# EAGLE design v3.3 (EAGLE 6.1)
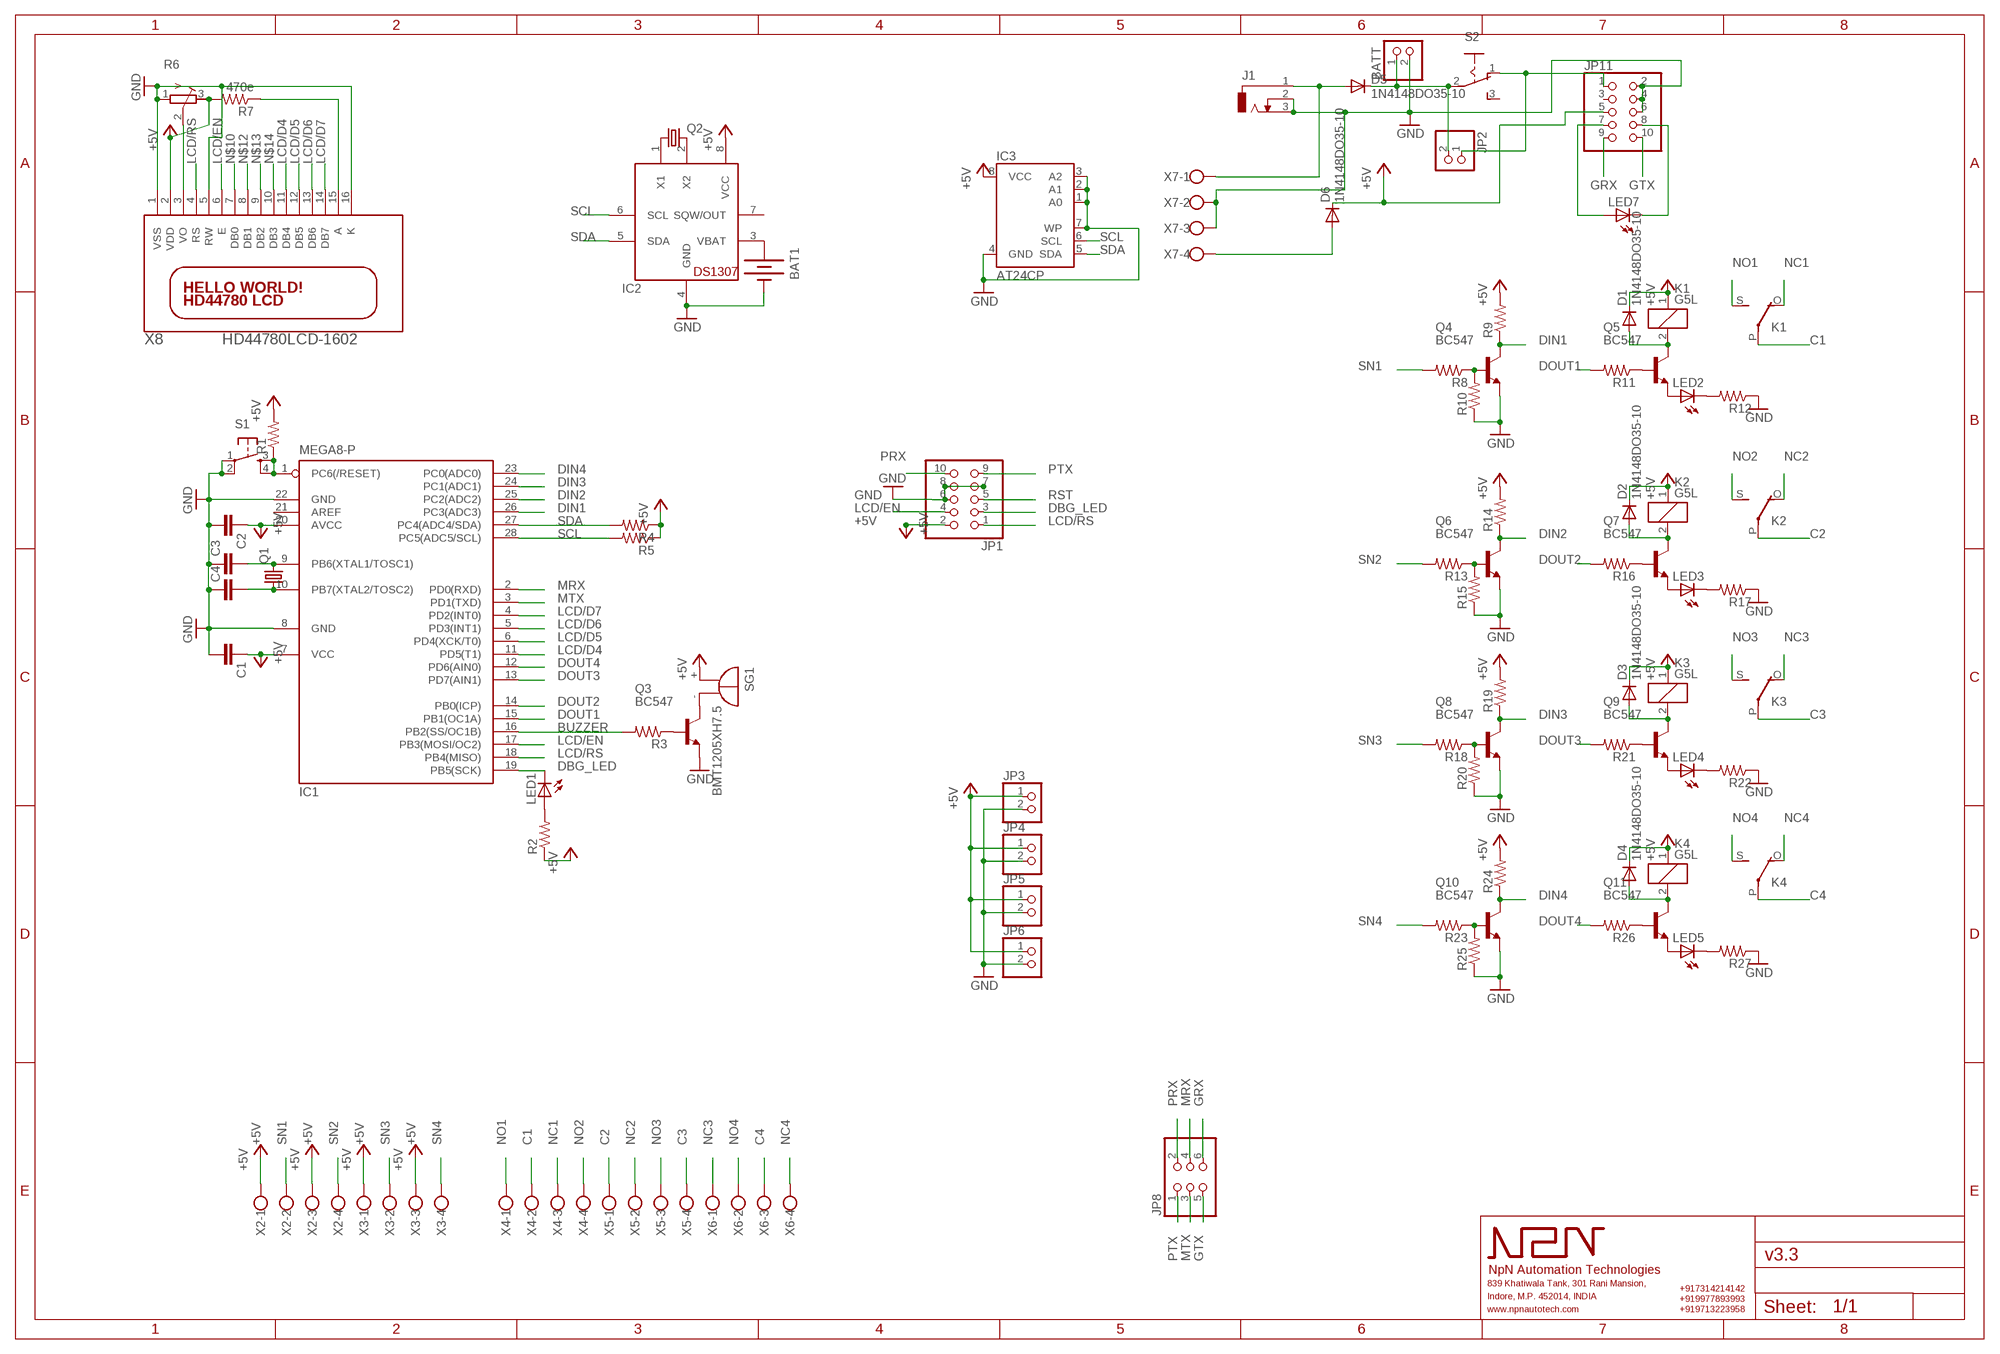
[diagram p0: schematic, sheet 1]

## Parts
BAT1  BATTERY20PTH  [BATTCOM_20MM_PTH]
BATT  PINHD-1X2  [1X02]
C1  C-EU050-025X075  [C050-025X075]
C2  C-EU050-025X075  [C050-025X075]
C3  C-EU050-025X075  [C050-025X075]
C4  C-EU050-025X075  [C050-025X075]
D1  1N4148DO35-10  [DO35-10]
D2  1N4148DO35-10  [DO35-10]
D3  1N4148DO35-10  [DO35-10]
D4  1N4148DO35-10  [DO35-10]
D5  1N4148DO35-10  [DO35-10]
D6  1N4148DO35-10  [DO35-10]
IC1  MEGA8-P  [DIL28-3]
IC2  DS1307  [DIL08]
IC3  AT24CP  [DIL08]
J1  DCJ0303  [DCJ0303]
JP1  PINHD-2X5/90  [2X05/90]
JP2  PINHD-1X2  [1X02]
JP3  PINHD-1X2  [1X02]
JP4  PINHD-1X2  [1X02]
JP5  PINHD-1X2  [1X02]
JP6  PINHD-1X2  [1X02]
JP8  PINHD-2X3/90  [2X03/90]
JP11  PINHD-2X5  [2X05]
K1  G5L  [G5LE]
K2  G5L  [G5LE]
K3  G5L  [G5LE]
K4  G5L  [G5LE]
LED1  LED5MM  [LED5MM]
LED2  LED5MM  [LED5MM]
LED3  LED5MM  [LED5MM]
LED4  LED5MM  [LED5MM]
LED5  LED5MM  [LED5MM]
LED7  LED5MM  [LED5MM]
Q1  CRYSTALHC49U-V  [HC49U-V]
Q2  CRYSTALTC38H  [TC38H]
Q3  BC547  [TO92]
Q4  BC547  [TO92]
Q5  BC547  [TO92]
Q6  BC547  [TO92]
Q7  BC547  [TO92]
Q8  BC547  [TO92]
Q9  BC547  [TO92]
Q10  BC547  [TO92]
Q11  BC547  [TO92]
R1  R-US_0207/10  [0207/10]
R2  R-US_0207/10  [0207/10]
R3  R-US_0207/10  [0207/10]
R4  R-US_0207/10  [0207/10]
R5  R-US_0207/10  [0207/10]
R6  R-TRIMM3339P  [RTRIM3339P]
R7  470e  R-US_0207/10  [0207/10]
R8  R-US_0207/10  [0207/10]
R9  R-US_0207/10  [0207/10]
R10  R-US_0207/10  [0207/10]
R11  R-US_0207/10  [0207/10]
R12  R-US_0207/10  [0207/10]
R13  R-US_0207/10  [0207/10]
R14  R-US_0207/10  [0207/10]
R15  R-US_0207/10  [0207/10]
R16  R-US_0207/10  [0207/10]
R17  R-US_0207/10  [0207/10]
R18  R-US_0207/10  [0207/10]
R19  R-US_0207/10  [0207/10]
R20  R-US_0207/10  [0207/10]
R21  R-US_0207/10  [0207/10]
R22  R-US_0207/10  [0207/10]
R23  R-US_0207/10  [0207/10]
R24  R-US_0207/10  [0207/10]
R25  R-US_0207/10  [0207/10]
R26  R-US_0207/10  [0207/10]
R27  R-US_0207/10  [0207/10]
S1  TAC_SWITCHPTH  [TACTILE-PTH]
S2  M251  [M251]
SG1  BMT1205XH7.5  [BMT1205XH7.5]
X2  W237-4  [W237-4]
X3  W237-4  [W237-4]
X4  W237-4  [W237-4]
X5  W237-4  [W237-4]
X6  W237-4  [W237-4]
X7  W237-4  [W237-4]
X8  HD44780LCD-1602  [LCD1602]

## Nets
+5V: C1.1 C2.1 D1.C D2.C D3.C D4.C D6.C IC1.7(VCC) IC1.20(AVCC) IC2.8(VCC) IC3.8(VCC) JP1.2 JP3.1 JP4.1 JP5.1 JP6.1 JP11.5 K1.1 K2.1 K3.1 K4.1 R1.2 R2.1 R4.1 R5.1 R9.2 R14.2 R19.2 R24.2 SG1.+ X2.1 X2.3 X3.1 X3.3
BUZZER: IC1.16(PB2(SS/OC1B)) R3.2
C1: K1.P(2:P) X4.2
C2: K2.P(2:P) X5.1
C3: K3.P(2:P) X5.4
C4: K4.P(2:P) X6.3
DBG_LED: IC1.19(PB5(SCK)) JP1.3 LED1.K(C)
DIN1: IC1.26(PC3(ADC3)) Q4.3(C) R9.1
DIN2: IC1.25(PC2(ADC2)) Q6.3(C) R14.1
DIN3: IC1.24(PC1(ADC1)) Q8.3(C) R19.1
DIN4: IC1.23(PC0(ADC0)) Q10.3(C) R24.1
DOUT1: IC1.15(PB1(OC1A)) R11.2
DOUT2: IC1.14(PB0(ICP)) R16.2
DOUT3: IC1.13(PD7(AIN1)) R21.2
DOUT4: IC1.12(PD6(AIN0)) R26.2
GND: BAT1.2(-) BATT.2 C1.2 C2.2 C3.1 C4.1 IC1.8(GND) IC1.22(GND) IC2.4(GND) IC3.1(A0) IC3.2(A1) IC3.3(A2) IC3.4(GND) IC3.7(WP) J1.2 J1.3 JP1.6 JP1.7 JP1.8 JP3.2 JP4.2 JP5.2 JP6.2 JP11.2 JP11.4 JP11.6 Q3.1(E) Q4.1(E) Q6.1(E) Q8.1(E) Q10.1(E) R10.1 R12.1 R15.1 R17.1 R20.1 R22.1 R25.1 R27.1 S1.1 S1.2 X7.2 X7.3
GRX: JP8.6 JP11.9
GTX: JP8.5 JP11.10
LCD/D4: IC1.11(PD5(T1)) X8.11(DB4)
LCD/D5: IC1.6(PD4(XCK/T0)) X8.12(DB5)
LCD/D6: IC1.5(PD3(INT1)) X8.13(DB6)
LCD/D7: IC1.4(PD2(INT0)) X8.14(DB7)
LCD/EN: IC1.17(PB3(MOSI/OC2)) JP1.4 X8.6(E)
LCD/RS: IC1.18(PB4(MISO)) JP1.1 X8.4(RS)
MRX: IC1.2(PD0(RXD)) JP8.4
MTX: IC1.3(PD1(TXD)) JP8.3
N$1: IC2.2(X2) Q2.2
N$2: R7.1 X8.15(A)
N$3: IC2.1(X1) Q2.1
N$4: LED1.A R2.2
N$5: C3.2 IC1.9(PB6(XTAL1/TOSC1)) Q1.2
N$6: C4.2 IC1.10(PB7(XTAL2/TOSC2)) Q1.1
N$7: Q3.2(B) R3.1
N$8: Q3.3(C) SG1.-
N$9: R6.2(S) X8.3(VO)
N$10: X8.7(DB0)
N$11: BAT1.1(+) IC2.3(VBAT)
N$12: X8.8(DB1)
N$13: X8.9(DB2)
N$14: X8.10(DB3)
N$15: D6.A X7.4
N$16: Q4.2(B) R8.1 R10.2
N$17: JP2.1 JP11.1 S2.1(O)
N$18: Q5.2(B) R11.1
N$19: LED2.A Q5.1(E)
N$20: LED2.K(C) R12.2
N$21: D1.A K1.2 Q5.3(C)
N$22: D5.A J1.1 X7.1
N$23: BATT.1 D5.C JP2.2 S2.2(P)
N$27: Q6.2(B) R13.1 R15.2
N$28: Q7.2(B) R16.1
N$29: LED3.A Q7.1(E)
N$30: LED3.K(C) R17.2
N$31: D2.A K2.2 Q7.3(C)
N$32: Q8.2(B) R18.1 R20.2
N$33: Q9.2(B) R21.1
N$34: LED4.A Q9.1(E)
N$35: LED4.K(C) R22.2
N$36: D3.A K3.2 Q9.3(C)
N$37: Q10.2(B) R23.1 R25.2
N$38: Q11.2(B) R26.1
N$39: LED5.A Q11.1(E)
N$40: LED5.K(C) R27.2
N$41: D4.A K4.2 Q11.3(C)
N$50: JP11.7 LED7.A
N$51: JP11.8 LED7.K(C)
NC1: K1.O(2:O) X4.3
NC2: K2.O(2:O) X5.2
NC3: K3.O(2:O) X6.1
NC4: K4.O(2:O) X6.4
NO1: K1.S(2:S) X4.1
NO2: K2.S(2:S) X4.4
NO3: K3.S(2:S) X5.3
NO4: K4.S(2:S) X6.2
PRX: JP1.10 JP8.2
PTX: JP1.9 JP8.1
RST: IC1.1(PC6(/RESET)) JP1.5 R1.1 S1.3 S1.4
SCL: IC1.28(PC5(ADC5/SCL)) IC2.6(SCL) IC3.6(SCL) R5.2
SDA: IC1.27(PC4(ADC4/SDA)) IC2.5(SDA) IC3.5(SDA) R4.2
SN1: R8.2 X2.2
SN2: R13.2 X2.4
SN3: R18.2 X3.2
SN4: R23.2 X3.4
VDD: R6.3(E) R7.2 X8.2(VDD) ; supply symbol labelled +5V
VSS: R6.1(A) X8.1(VSS) X8.5(RW) X8.16(K) ; supply symbol labelled GND
Unconnected: IC1.21(AREF) IC2.7(SQW/OUT) JP11.3 S2.3(S)

## Library data of the parts
BAT1 = SparkFun-Electromechanical:BATTERY: Battery Holders Various common sizes : AA, AAA, 20mm coin cell and 12mm coin cell. 20MM_4LEGS, BATT-10373
BATT JP2-JP6 = pinhead:PINHD-1X2: PIN HEADER
C1-C4 = rcl:C-EU: CAPACITOR, European symbol
D1-D6 = diode:1N4148: DIODE high speed (Philips)
IC1 = atmel:MEGA8-P: MICROCONTROLLER 8 Kbytes FLASH, 1 kbytes SRAM, 512 bytes EEPROM, USART, 4-channel 10 bit ADC, 2-channel 8 bit ADC Pin compatible with Atmega48, ATMega88, ATMega168 Source: avr.lbr; OC_FARNELL: unknown; OC_NEWARK: unknown
IC2 = adafruit:DS1307: DS1307 Real time clock (RTC) with battery backup ability. Talk to it via i2c
IC3 = atmel:AT24C*: 2-wire serial EEPROM; MPN: AT24C1024BW-SH-B; OC_FARNELL: 1362646; OC_NEWARK: 03P2044
J1 = con-jack:DCJ0303: DC POWER JACK Source: DCJ0303.pdf; OC_FARNELL: unknown; OC_NEWARK: unknown
JP1 JP11 = pinhead:PINHD-2X5: PIN HEADER
JP8 = pinhead:PINHD-2X3: PIN HEADER
K1-K4 = relay:G5L: RELAY 1 x switch, 10 A/120 V AC, 8 A/30 V ADC, Omron; OC_FARNELL: unknown; OC_NEWARK: unknown
LED1-LED5 LED7 = led:LED: LED OSRAM: - CHIPLED LG R971, LG N971, LY N971, LG Q971, LY Q971, LO R971, LY R971 LH N974, LH R974 LS Q976, LO Q976, LY Q976 LO Q996 - Hyper CHIPLED LW Q18S LB Q993, LB Q99A, LB R99A - SideLED LS A670, LO A670, LY A670, LG A670, LP A670 LB A673, LV A673, LT A673, LW A673 LH A674 LY A675 LS A676, LA A676, LO A676, LY A676, LW A676 LS A679, LY A679, LG A679 - Hyper Micro SIDELED® LS Y876, LA Y876, LO Y876, LY Y876 LT Y87S - SmartLED LW L88C, LW L88S LB L89C, LB L89S, LG L890 LS L89K, LO L89K, LY L89K LS L896, LA L896, LO L896, LY L896 - TOPLED LS T670, LO T670, LY T670, LG T670, LP T670 LSG T670, LSP T670, LSY T670, LOP T670, LYG T670 LG T671, LOG T671, LSG T671 LB T673, LV T673, LT T673, LW T673 LH T674 LS T676, LA T676, LO T676, LY T676, LB T676, LH T676, LSB T676, LW T676 LB T67C, LV T67C, LT T67C, LS T67K, LO T67K, LY T67K, LW E67C LS E67B, LA E67B, LO E67B, LY E67B, LB E67C, LV E67C, LT E67C LW T67C LS T679, LY T679, LG T679 LS T770, LO T770, LY T770, LG T770, LP T770 LB T773, LV T773, LT T773, LW T773 LH T774 LS E675, LA E675, LY E675, LS T675 LS T776, LA T776, LO T776, LY T776, LB T776 LHGB T686 LT T68C, LB T68C - Hyper Mini TOPLED® LB M676 - Mini TOPLED Santana® LG M470 LS M47K, LO M47K, LY M47K Source: http://www.osram.convergy.de LUXEON: - LUMILED® LXK2-PW12-R00, LXK2-PW12-S00, LXK2-PW14-U00, LXK2-PW14-V00 LXK2-PM12-R00, LXK2-PM12-S00, LXK2-PM14-U00 LXK2-PE12-Q00, LXK2-PE12-R00, LXK2-PE12-S00, LXK2-PE14-T00, LXK2-PE14-U00 LXK2-PB12-K00, LXK2-PB12-L00, LXK2-PB12-M00, LXK2-PB14-N00, LXK2-PB14-P00, LXK2-PB14-Q00 LXK2-PR12-L00, LXK2-PR12-M00, LXK2-PR14-Q00, LXK2-PR14-R00 LXK2-PD12-Q00, LXK2-PD12-R00, LXK2-PD12-S00 LXK2-PH12-R00, LXK2-PH12-S00 LXK2-PL12-P00, LXK2-PL12-Q00, LXK2-PL12-R00 Source: www.luxeon.com KINGBRIGHT: KA-3528ASYC Source: www.kingbright.com
Q1 = crystal:CRYSTAL: CRYSTAL; OC_FARNELL: 1666969; OC_NEWARK: unknown
Q2 = crystal:CRYSTAL: CRYSTAL; OC_FARNELL: unknown; OC_NEWARK: unknown
Q3-Q11 = transistor-npn:BC547*: NPN Transistor
R1-R5 R7-R27 = rcl:R-US_: RESISTOR, American symbol
R6 = rcl:R-TRIMM: Trimm resistor
S1 = SparkFun-Electromechanical:TAC_SWITCH: Momentary Switch Button commonly used for reset or general input. Spark Fun Electronics SKU : COM-00097 SMT- SWCH-08247
S2 = switch:M251: SLIDING SWITCH Mors, distributor Buerklin, 11G702
SG1 = buzzer:BMT1205XH7.5: MAGNETIC TRANSDUCER Source: Http:www.be-star.com; OC_FARNELL: unknown; OC_NEWARK: unknown
X2-X7 = con-wago-500:W237-4: WAGO SCREW CLAMP; OC_FARNELL: unknown; OC_NEWARK: unknown
X8 = adafruit_NPN:HD44780LCD: HD44780 LCD Standard character type LCDs, available in sizes from 8x1 to 40x4!

## Board
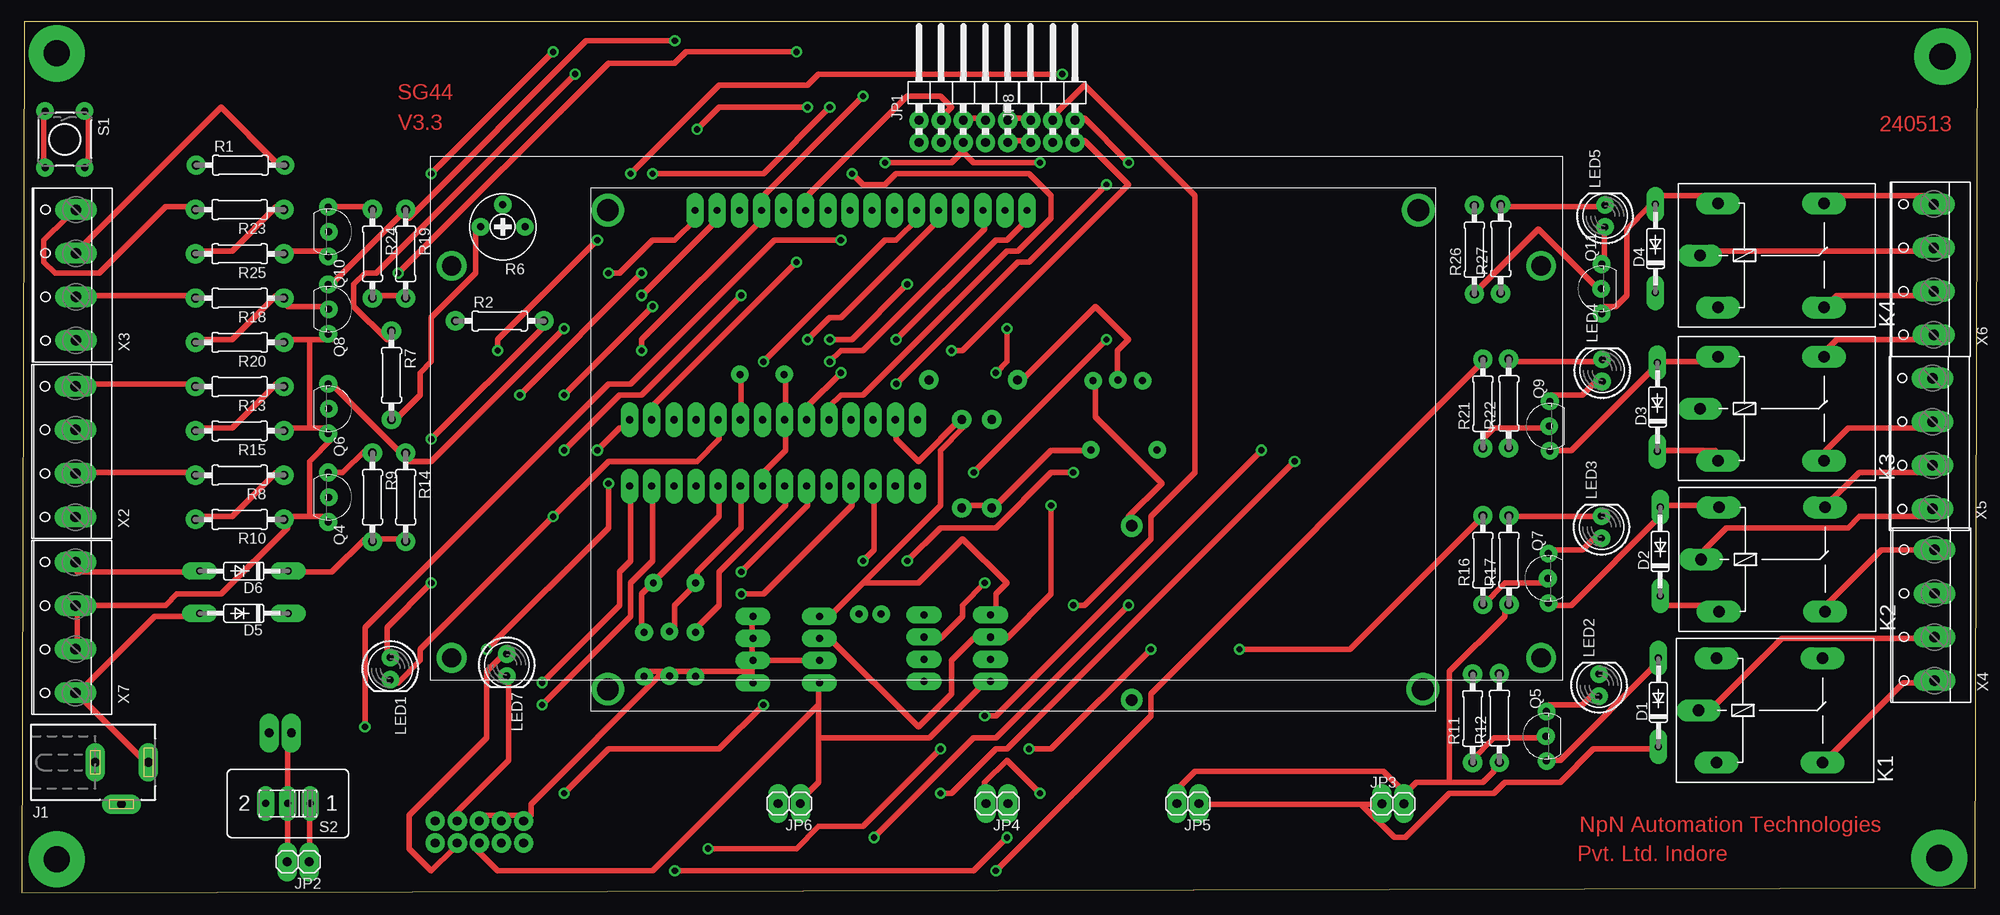
[diagram p1: board, top side]
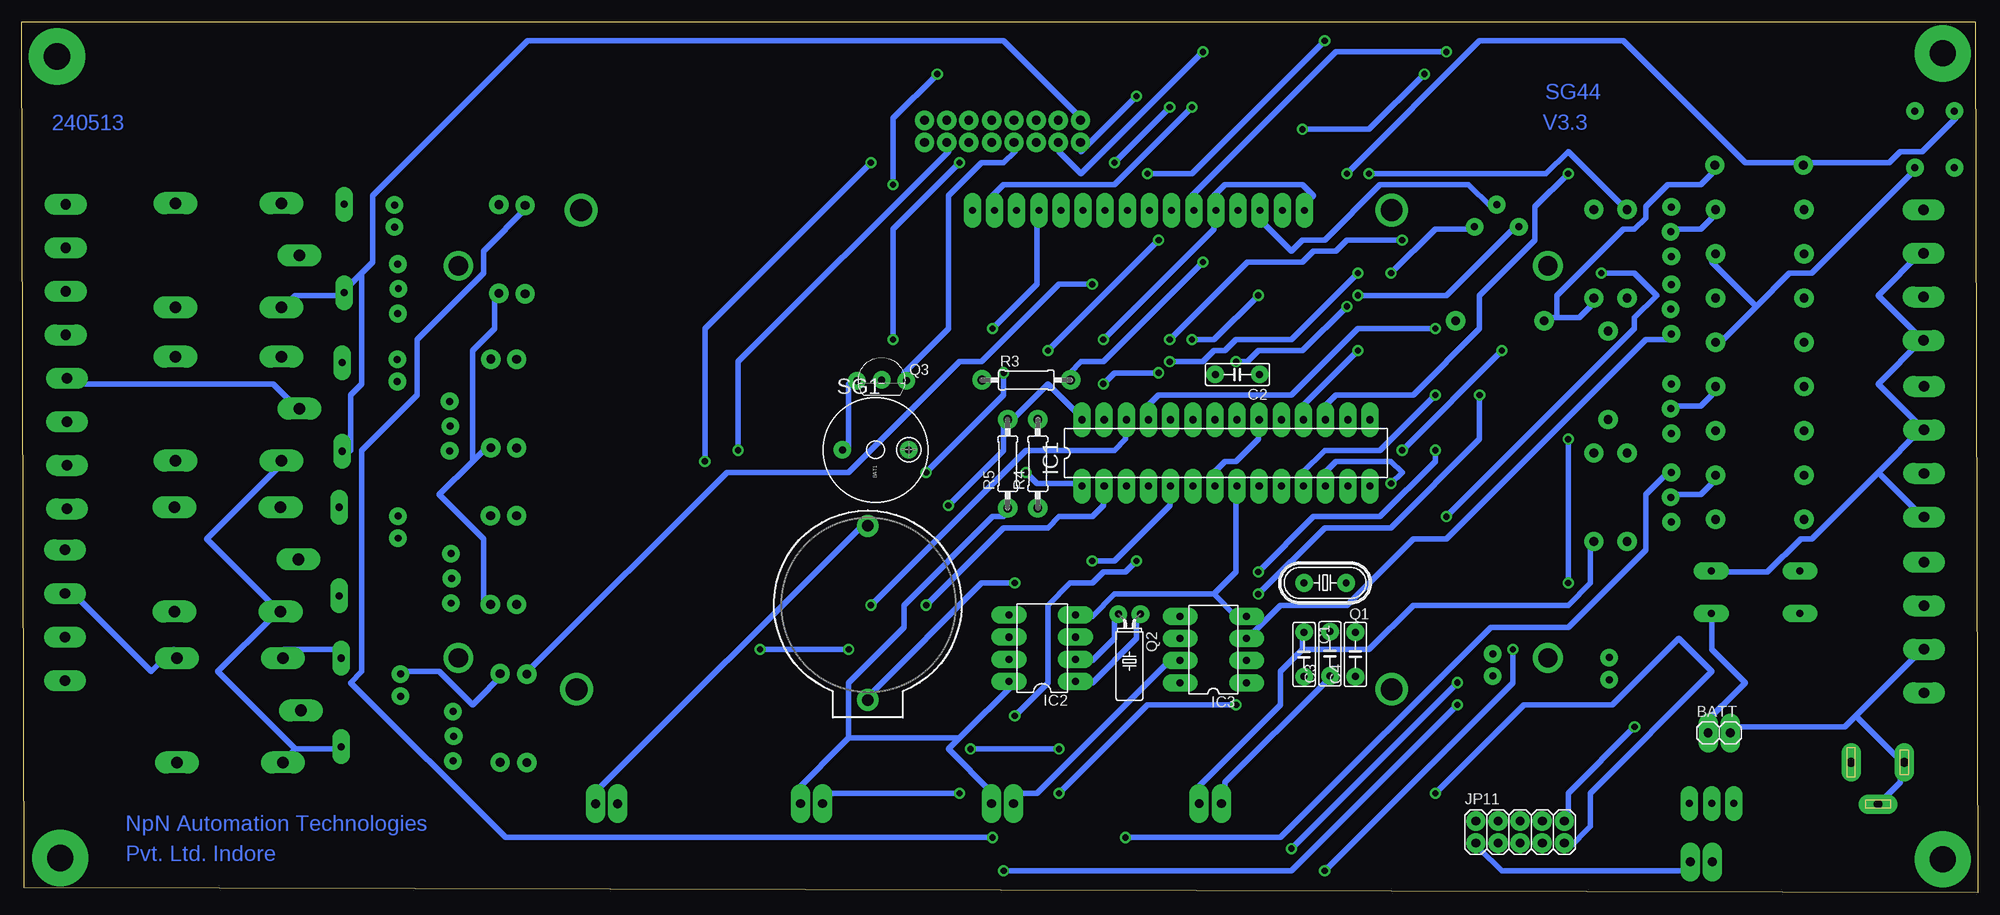
[diagram p2: board, bottom side, seen from below]

Size 224.42 x 99.98 mm. Coordinates in mm from the lower left corner, seen from the top.
Outline: 0,0 224.12,0.57 224.42,99.96 0.3,99.98 0,0
Copper layers (1*16): Top 0.035mm / dielectric 1.5mm / Bottom 0.035mm
Design rules: minimum track width 24mil, minimum drill 28mil, track to track 20mil, track to pad 20mil, pad to pad 20mil, via to via 20mil, smd to smd 20mil, copper to edge 40mil, drill to drill 16mil, minimum pad ring 24mil, minimum via ring 11mil, stop-mask expansion 16mil, vias tented up to drill 0mil, thermal gap 16mil

### Footprints (pad centres in the part's own frame; a part is rotated, then mirrored left to right if it is on the bottom)
BATTCOM_20MM_PTH = drill 1.3: 1 20,0; 2 0,0
1X02 = drill 1.016 long: 1 -1.27,0; 2 1.27,0
C050-025X075 = drill 0.8 pad 1.93: 1 -2.54,0; 2 2.54,0
DO35-10 = drill 0.813 long: A 5.08,0; C -5.08,0
DIL28-3 = drill 0.813 long: 1 -16.51,-3.81; 2 -13.97,-3.81; 3 -11.43,-3.81; 4 -8.89,-3.81; 5 -6.35,-3.81; 6 -3.81,-3.81; 7 -1.27,-3.81; 8 1.27,-3.81; 9 3.81,-3.81; 10 6.35,-3.81; 11 8.89,-3.81; 12 11.43,-3.81; 13 13.97,-3.81; 14 16.51,-3.81; 15 16.51,3.81; 16 13.97,3.81; 17 11.43,3.81; 18 8.89,3.81; 19 6.35,3.81; 20 3.81,3.81; 21 1.27,3.81; 22 -1.27,3.81; 23 -3.81,3.81; 24 -6.35,3.81; 25 -8.89,3.81; 26 -11.43,3.81; 27 -13.97,3.81; 28 -16.51,3.81
DIL08 = drill 0.813 long: 1 -3.81,-3.81; 2 -1.27,-3.81; 3 1.27,-3.81; 4 3.81,-3.81; 5 3.81,3.81; 6 1.27,3.81; 7 -1.27,3.81; 8 -3.81,3.81
DCJ0303 = drill 1 pad 2 long: 1 0,3.1; 2 4.8,0; 3 0,-3
2X05/90 = drill 1 pad 2.184: 1 -5.08,-6.35; 2 -5.08,-3.81; 3 -2.54,-6.35; 4 -2.54,-3.81; 5 0,-6.35; 6 0,-3.81; 7 2.54,-6.35; 8 2.54,-3.81; 9 5.08,-6.35; 10 5.08,-3.81
2X03/90 = drill 1 pad 2.184: 1 -2.54,-6.35; 2 -2.54,-3.81; 3 0,-6.35; 4 0,-3.81; 5 2.54,-6.35; 6 2.54,-3.81
2X05 = drill 1 pad 2.184: 1 -5.08,-1.27; 2 -5.08,1.27; 3 -2.54,-1.27; 4 -2.54,1.27; 5 0,-1.27; 6 0,1.27; 7 2.54,-1.27; 8 2.54,1.27; 9 5.08,-1.27; 10 5.08,1.27
G5LE = drill 1.321 long: 1 -7.493,-5.969; 2 -7.493,5.969; O 4.699,5.969; P -9.525,0; S 4.699,-5.969
LED5MM = drill 0.8 pad 1.778: A -1.27,0; K 1.27,0
HC49U-V = drill 0.8 pad 1.93: 1 -2.413,0; 2 2.413,0
TC38H = drill 0.8 pad 1.93: 1 -1.27,0; 2 1.27,0
TO92 = drill 0.8 pad 1.93: 1 2.84,0; 2 0,0.075; 3 -2.84,0
0207/10 = drill 1 pad 2.184: 1 -5.08,0; 2 5.08,0
RTRIM3339P = drill 0.8 pad 1.93: 1 -2.54,0; 2 0,-2.54; 3 2.54,0
TACTILE-PTH = drill 0.8 pad 1.93: 1 -3.251,2.261; 2 3.251,2.261; 3 -3.251,-2.261; 4 3.251,-2.261
M251 = drill 0.813 long: 1 -2.54,0; 2 0,0; 3 2.54,0
BMT1205XH7.5 = drill 0.8 pad 1.93: + 3.8,0; - -3.8,0
SIM300_OUTLINE = drill 2.2: P$1 2.5,2.5; P$2 2.5,47.5; P$3 127.5,2.5; P$4 127.5,47.5
W237-4 = drill 1.194 long: 1 -7.5,-1.27; 2 -2.5,-1.27; 3 2.5,-1.27; 4 7.5,-1.27
LCD1602 = drill 0.8 long: 1 12,57.96; 2 14.54,57.96; 3 17.08,57.96; 4 19.62,57.96; 5 22.16,57.96; 6 24.7,57.96; 7 27.24,57.96; 8 29.78,57.96; 9 32.32,57.96; 10 34.86,57.96; 11 37.4,57.96; 12 39.94,57.96; 13 42.48,57.96; 14 45.02,57.96; 15 47.56,57.96; 16 50.1,57.96 | drill 2.5: P$1 2,58; P$2 95,58; P$3 2,3; P$4 95.5,3

### Placement (x,y rotation side)
BAT1  127.35,42.13 270 bottom
BATT  29.67,18.36 0 bottom
C1  77.29,27.37 270 bottom
C2  84.94,59.5 180 bottom
C3  74.32,27.45 90 bottom
C4  71.4,27.37 90 bottom
D1  187.78,21.86 90 top
D2  187.99,39.18 90 top
D3  187.68,55.77 90 top
D4  187.45,73.96 90 top
D5  25.48,32.08 180 top
D6  25.48,36.93 180 top
IC1  86.26,50.49 0 bottom
IC2  107.34,28.08 90 bottom
IC3  87.7,27.93 90 bottom
J1  11.43,14.99 270 top
JP1  108.03,92.48 0 top
JP2  31.72,3.56 180 top
JP3  157.33,10.23 0 top
JP4  111.89,10.25 180 top
JP5  133.81,10.25 180 top
JP6  88.06,10.25 180 top
JP8  118.3,92.48 0 top
JP11  52.5,6.99 0 bottom
K1  201.93,20.95 0 top
K2  202.21,38.27 0 top
K3  202.11,55.57 0 top
K4  202.11,73.17 0 top
LED1  42.29,25.74 270 top
LED2  180.98,23.84 90 top
LED3  181.26,41.98 90 top
LED4  181.33,59.96 90 top
LED5  181.66,77.69 90 top
LED7  55.65,26.16 270 top
Q1  74.88,35.58 180 bottom
Q2  97.33,32 180 bottom
Q3  125.77,58.8 0 bottom
Q4  35.16,45.41 270 top
Q5  174.95,17.98 90 top
Q6  35.16,55.57 270 top
Q7  175.18,36.09 90 top
Q8  35.16,67 270 top
Q9  175.33,53.57 90 top
Q10  35.16,75.89 270 top
Q11  181.28,69.33 90 top
R1  25.09,83.53 0 top
R2  54.84,65.64 0 top
R3  109.17,58.87 0 bottom
R4  107.84,49.25 90 bottom
R5  111.29,49.25 90 bottom
R6  55.19,76.45 180 top
R7  42.42,59.4 270 top
R8  25,47.95 180 top
R9  40.24,45.41 270 top
R10  25,42.87 180 top
R11  166.47,20.02 90 top
R12  169.55,20.07 90 top
R13  25,58.11 180 top
R14  44.05,45.41 270 top
R15  25,53.03 180 top
R16  167.64,38.19 90 top
R17  170.64,38.19 90 top
R18  25,68.27 180 top
R19  44.05,73.35 270 top
R20  25,63.19 180 top
R21  167.64,56.15 90 top
R22  170.61,56.18 90 top
R23  25,78.43 180 top
R24  40.24,73.35 270 top
R25  25,73.35 180 top
R26  166.66,73.83 90 top
R27  169.69,73.91 90 top
S1  4.94,86.49 270 top
S2  30.53,10.26 180 top
SG1  126.46,50.85 0 bottom
U$1  SIM300_OUTLINE  [SIM300_OUTLINE]  46.83,24.47 0 top
X2  4.88,50.64 90 top
X3  4.93,70.91 90 top
X4  218.19,31.87 90 top
X5  217.99,51.58 90 top
X6  218.11,71.54 90 top
X7  4.88,30.45 90 top
X8  65.25,20.37 0 top

### Tracks (layer width: path | path; a pad name or v marks a point on that pad's centre or on a via)
+5V
  Top 0.61: D2.C 187.96,33.02 194.31,33.02 K2.1 | D3.C 187.96,50.8 194.31,50.8 K3.1 | D6.C 31.75,36.83 35.56,36.83 39.37,40.64 R9.2 40.64,40.64 43.18,40.64 R14.2 | R24.2 40.64,68.58 43.18,68.58 R19.2 | R1.2 29.21,83.82 22.86,90.17 6.35,73.66 X3.3 | SG1.+ 121.92,50.8 118.11,50.8 111.76,44.45 R5.1 110.49,44.45 107.95,44.45 R4.1 | 153.67,10.16 135.89,10.16 JP5.1 | 153.67,10.16 156.21,10.16 JP3.1 | C2.1 82.55,59.69 82.55,54.61 IC1.20 | 91.44,17.78 91.44,12.7 90.17,11.43 JP6.1 | 91.44,17.78 91.44,21.59 | 91.44,21.59 91.44,24.13 IC3.8 | 91.44,17.78 104.14,17.78 110.49,24.13 IC2.8 | IC1.7 87.63,45.72 87.63,44.45 80.01,36.83 80.01,33.02 77.47,30.48 C1.1 | 91.44,21.59 72.39,2.54 54.61,2.54 52.07,5.08 JP11.5 | 153.67,10.16 157.48,6.35 158.75,6.35 163.83,11.43 168.91,11.43 170.18,12.7 176.53,12.7 180.34,16.51 187.96,16.51 D1.C
  Bottom 0.61: 193.04,16.51 187.96,16.51 D1.C | 193.04,16.51 194.31,15.24 K1.1 | 193.04,16.51 201.93,25.4 195.58,31.75 K2.1 195.58,33.02 203.2,40.64 194.31,49.53 K3.1 | K4.1 194.31,67.31 193.04,68.58 187.96,68.58 D4.C 186.69,69.85 185.42,71.12 | 185.42,71.12 184.15,72.39 184.15,80.01 166.37,97.79 111.76,97.79 102.87,88.9 JP1.2 | 185.42,71.12 185.42,58.42 186.69,57.15 186.69,50.8 D3.C | 11.43,48.26 6.35,43.18 X2.1 | 6.35,53.34 11.43,48.26 | 48.26,66.04 45.72,66.04 44.45,67.31 R19.2 | 48.26,66.04 49.53,66.04 R2.1 | 6.35,63.5 11.43,68.58 6.35,73.66 X3.3 | 48.26,66.04 48.26,68.58 40.64,76.2 39.37,76.2 38.1,77.47 38.1,78.74 35.56,81.28 31.75,81.28 30.48,82.55 R1.2 | 6.35,53.34 11.43,58.42 6.35,63.5 | 6.35,53.34 X2.3 | 6.35,63.5 X3.1 | 11.43,48.26 19.05,40.64 20.32,40.64 24.13,36.83 30.48,36.83 D6.C | 129.54,17.78 129.54,24.13 123.19,30.48 123.19,33.02 113.03,43.18 111.76,43.18 R5.1 | 129.54,17.78 135.89,11.43 JP5.1 | 77.47,27.94 77.47,29.21 C1.1 | 77.47,27.94 80.01,25.4 80.01,21.59 90.17,11.43 JP6.1 | 116.84,17.78 110.49,24.13 IC2.8 | 116.84,17.78 118.11,16.51 113.03,11.43 JP4.1 | IC1.20 82.55,53.34 82.55,52.07 85.09,49.53 86.36,49.53 87.63,48.26 87.63,46.99 IC1.7 | 116.84,17.78 129.54,17.78 | 77.47,27.94 69.85,27.94 64.77,33.02 46.99,33.02 44.45,35.56 44.45,39.37 R14.2
BUZZER  (via drill 0.71)
  Top 0.61: v88.9,72.39 72.39,55.88 72.39,54.61 IC1.16
  Bottom 0.61: v88.9,72.39 100.33,60.96 102.87,60.96 104.14,59.69 R3.2
C1
  Top 0.61: X4.2 218.44,29.21 201.93,29.21 193.04,20.32 K1.P
C2
  Top 0.61: X5.1 218.44,43.18 210.82,43.18 209.55,41.91 195.58,41.91 193.04,39.37 K2.P
C3
  Bottom 0.61: X5.4 218.44,58.42 195.58,58.42 193.04,55.88 K3.P
C4
  Top 0.61: X6.3 218.44,73.66 193.04,73.66 K4.P
DBG_LED  (via drill 0.71)
  Top 0.61: LED1.K 43.18,24.13 45.72,26.67 45.72,27.94 v60.96,43.18 67.31,49.53 77.47,49.53 80.01,52.07 80.01,53.34 IC1.19 | v88.9,96.52 76.2,96.52 74.93,95.25 67.31,95.25 v43.18,71.12
  Bottom 0.61: v88.9,96.52 102.87,82.55 105.41,85.09 JP1.3 | v43.18,71.12 39.37,71.12 36.83,68.58 39.37,66.04 39.37,64.77 v60.96,43.18
DIN1  (via drill 0.71)
  Top 0.61: Q4.3 35.56,48.26 36.83,48.26 39.37,50.8 R9.1 | v127,33.02 111.76,17.78 109.22,17.78 v97.79,6.35
  Bottom 0.61: v127,33.02 109.22,50.8 99.06,50.8 97.79,52.07 97.79,53.34 IC1.26 | v97.79,6.35 80.01,6.35 55.88,30.48 46.99,30.48 38.1,39.37 38.1,45.72 35.56,48.26 Q4.3
DIN2  (via drill 0.71)
  Top 0.61: Q6.3 35.56,58.42 43.18,50.8 R14.1 44.45,49.53 46.99,49.53 v62.23,64.77
  Bottom 0.61: v62.23,64.77 71.12,64.77 78.74,57.15 93.98,57.15 95.25,55.88 95.25,54.61 IC1.25
DIN3  (via drill 0.71)
  Top 0.61: Q8.3 35.56,69.85 44.45,78.74 R19.1 44.45,77.47 64.77,97.79 v74.93,97.79 | v95.25,82.55 96.52,81.28 99.06,81.28 100.33,82.55 115.57,82.55 118.11,80.01 118.11,77.47 114.3,73.66 113.03,73.66 96.52,57.15 93.98,57.15 92.71,55.88 92.71,54.61 IC1.24
  Bottom 0.61: v95.25,82.55 90.17,82.55 v74.93,97.79
DIN4  (via drill 0.71)
  Top 0.61: Q10.3 35.56,78.74 39.37,78.74 R24.1 | v93.98,59.69 90.17,55.88 90.17,54.61 IC1.23 | v100.33,58.42 114.3,72.39 115.57,72.39 v124.46,81.28 | v119.38,93.98 91.44,93.98 90.17,92.71 80.01,92.71 v69.85,82.55
  Bottom 0.61: v93.98,59.69 99.06,59.69 v100.33,58.42 | v124.46,81.28 124.46,88.9 v119.38,93.98 | v69.85,82.55 49.53,82.55 46.99,85.09 40.64,78.74 R24.1
DOUT1  (via drill 0.71)
  Top 0.61: v66.04,50.8 68.58,53.34 69.85,53.34 IC1.15 | v54.61,62.23 54.61,63.5 v66.04,74.93 | v92.71,63.5 95.25,63.5 v101.6,69.85
  Bottom 0.61: v54.61,62.23 v66.04,50.8 | v66.04,74.93 72.39,74.93 73.66,73.66 76.2,73.66 77.47,72.39 83.82,72.39 v92.71,63.5 | v101.6,69.85 105.41,69.85 114.3,60.96 116.84,60.96 129.54,48.26 143.51,48.26 166.37,25.4 R11.2
DOUT2  (via drill 0.71)
  Top 0.61: v59.69,24.13 68.58,33.02 68.58,36.83 69.85,38.1 69.85,45.72 IC1.14 | v78.74,5.08 88.9,5.08 91.44,7.62 96.52,7.62 v105.41,16.51 | v115.57,16.51 118.11,16.51 v129.54,27.94 | v139.7,27.94 152.4,27.94 167.64,43.18 R16.2
  Bottom 0.61: v78.74,5.08 v59.69,24.13 | v115.57,16.51 v105.41,16.51 | v139.7,27.94 v129.54,27.94
DOUT3  (via drill 0.71)
  Top 0.61: v59.69,21.59 69.85,31.75 69.85,35.56 72.39,38.1 72.39,45.72 IC1.13 | v111.76,2.54 129.54,20.32 129.54,22.86 167.64,60.96 R21.2
  Bottom 0.61: v59.69,21.59 78.74,2.54 v111.76,2.54
DOUT4  (via drill 0.71)
  Top 0.61: v67.31,46.99 67.31,41.91 v53.34,27.94 | v74.93,2.54 109.22,2.54 v113.03,6.35
  Bottom 0.61: v67.31,46.99 66.04,48.26 67.31,49.53 73.66,49.53 74.93,48.26 74.93,46.99 IC1.12 | v53.34,27.94 53.34,24.13 v74.93,2.54 | v113.03,6.35 168.91,6.35 186.69,24.13 185.42,25.4 185.42,50.8 179.07,57.15 179.07,63.5 171.45,71.12 171.45,73.66 166.37,78.74 R26.2
GND  (via drill 0.71)
  Top 0.61: JP1.7 110.49,86.36 110.49,87.63 JP1.8 110.49,88.9 107.95,88.9 JP1.6 | Q3.1 123.19,58.42 123.19,54.61 130.81,46.99 127,43.18 BAT1.2 | 163.83,12.7 160.02,12.7 158.75,11.43 | 163.83,12.7 167.64,12.7 168.91,13.97 168.91,15.24 R12.1 | 158.75,11.43 156.21,13.97 134.62,13.97 132.08,11.43 JP5.2 | 158.75,11.43 JP3.2 | 163.83,12.7 163.83,25.4 170.18,31.75 170.18,33.02 R17.1 | X7.2 6.35,27.94 6.35,31.75 X7.3 6.35,33.02 16.51,33.02 17.78,34.29 22.86,34.29 30.48,41.91 R10.1 30.48,43.18 33.02,43.18 | 33.02,43.18 35.56,43.18 Q4.1 | 33.02,53.34 30.48,53.34 R15.1 | 33.02,53.34 35.56,53.34 Q6.1 35.56,52.07 33.02,49.53 33.02,43.18 | S1.2 7.62,83.82 7.62,88.9 S1.1 | Q10.1 35.56,73.66 30.48,73.66 R25.1 | 33.02,63.5 30.48,63.5 R20.1 | 33.02,63.5 35.56,63.5 Q8.1 | 33.02,63.5 33.02,53.34 | JP11.6 53.34,8.89 54.61,8.89 JP11.4 55.88,8.89 57.15,8.89 JP11.2 58.42,8.89 58.42,10.16 73.66,25.4 | 73.66,25.4 71.12,25.4 C4.1 | 77.47,25.4 74.93,25.4 C3.1 73.66,25.4 | 83.82,26.67 83.82,25.4 | 83.82,25.4 83.82,24.13 IC3.1 | IC3.7 91.44,26.67 85.09,26.67 IC3.2 83.82,26.67 | C2.2 87.63,59.69 87.63,54.61 IC1.22 87.63,53.34 87.63,50.8 85.09,48.26 85.09,46.99 IC1.8 | 104.14,31.75 IC2.4 | 83.82,29.21 83.82,31.75 IC3.4 | 83.82,29.21 83.82,26.67 | 83.82,29.21 IC3.3 | 83.82,25.4 77.47,25.4 | 77.47,25.4 C1.2 | v116.84,11.43 113.03,15.24 110.49,12.7 110.49,11.43 JP4.2
  Bottom 0.61: JP1.7 110.49,85.09 111.76,83.82 114.3,83.82 118.11,80.01 118.11,64.77 123.19,59.69 Q3.1 | 172.72,49.53 171.45,50.8 R22.1 | 172.72,49.53 176.53,45.72 171.45,40.64 171.45,33.02 R17.1 | 172.72,49.53 172.72,62.23 170.18,64.77 170.18,68.58 R27.1 | BAT1.2 128.27,41.91 158.75,11.43 JP3.2 | J1.2 11.43,10.16 8.89,12.7 8.89,13.97 J1.3 8.89,15.24 13.97,20.32 | 13.97,20.32 6.35,27.94 X7.2 | 13.97,20.32 15.24,19.05 27.94,19.05 BATT.2 | 25.4,67.31 30.48,72.39 R25.1 | 25.4,67.31 29.21,63.5 R20.1 | 25.4,67.31 21.59,71.12 19.05,71.12 7.62,82.55 S1.2 | JP6.2 86.36,11.43 86.36,12.7 74.93,24.13 C3.1 | JP4.2 110.49,11.43 107.95,11.43 92.71,26.67 IC3.7 | 87.63,34.29 99.06,34.29 101.6,31.75 102.87,31.75 IC2.4 | 87.63,34.29 85.09,31.75 IC3.4 | 87.63,34.29 85.09,36.83 85.09,45.72 IC1.8 | Q8.1 35.56,63.5 38.1,63.5 60.96,40.64 64.77,40.64 72.39,33.02 80.01,33.02 83.82,29.21 IC3.3 | v116.84,11.43 132.08,11.43 JP5.2
GRX  (via drill 0.71)
  Top 0.61: v62.23,11.43 67.31,16.51 80.01,16.51 v85.09,21.59 | v105.41,11.43 106.68,11.43 111.76,16.51 113.03,16.51 v146.05,49.53 | v127,83.82 121.92,88.9 JP8.6
  Bottom 0.61: v62.23,11.43 52.07,21.59 41.91,21.59 34.29,29.21 30.48,25.4 44.45,11.43 44.45,7.62 46.99,5.08 JP11.9 | v85.09,21.59 95.25,21.59 v105.41,11.43 | v146.05,49.53 146.05,64.77 v127,83.82
GTX  (via drill 0.71)
  Top 0.61: v39.37,19.05 39.37,30.48 67.31,58.42 69.85,58.42 86.36,74.93 v93.98,74.93 | v106.68,62.23 107.95,62.23 127,81.28 121.92,86.36 JP8.5
  Bottom 0.61: v39.37,19.05 46.99,11.43 46.99,8.89 JP11.10 | v106.68,62.23 v93.98,74.93
LCD/D4  (via drill 0.71)
  Top 0.61: v85.09,60.96 99.06,74.93 100.33,74.93 102.87,77.47 X8.11 | v62.23,57.15 v72.39,67.31
  Bottom 0.61: v85.09,60.96 83.82,60.96 82.55,62.23 77.47,62.23 v72.39,67.31 | v62.23,57.15 68.58,50.8 74.93,50.8 77.47,48.26 77.47,46.99 IC1.11
LCD/D5  (via drill 0.71)
  Top 0.61: v90.17,63.5 92.71,66.04 93.98,66.04 105.41,77.47 X8.12 | v82.55,68.58 71.12,57.15 68.58,57.15 v62.23,50.8 | v82.55,36.83 90.17,44.45 90.17,45.72 IC1.6
  Bottom 0.61: v90.17,63.5 87.63,63.5 v82.55,68.58 | v62.23,50.8 62.23,49.53 68.58,43.18 76.2,43.18 v82.55,36.83
LCD/D6  (via drill 0.71)
  Top 0.61: v113.03,64.77 113.03,60.96 v111.76,59.69 | v120.65,48.26 118.11,48.26 111.76,41.91 105.41,41.91 v101.6,38.1
  Bottom 0.61: v113.03,64.77 107.95,69.85 107.95,77.47 X8.13 | v111.76,59.69 111.76,57.15 v120.65,48.26 | v101.6,38.1 99.06,38.1 92.71,44.45 92.71,45.72 IC1.5
LCD/D7  (via drill 0.71)
  Top 0.61: v92.71,60.96 93.98,62.23 96.52,62.23 110.49,76.2 110.49,77.47 X8.14 | v57.15,57.15 v71.12,71.12 | v82.55,34.29 85.09,34.29 95.25,44.45 95.25,45.72 IC1.4
  Bottom 0.61: v92.71,60.96 88.9,60.96 87.63,62.23 86.36,62.23 85.09,63.5 78.74,63.5 v71.12,71.12 | v57.15,57.15 57.15,52.07 67.31,41.91 74.93,41.91 v82.55,34.29
LCD/EN  (via drill 0.71)
  Top 0.61: X8.6 90.17,78.74 90.17,80.01 101.6,91.44 105.41,91.44 106.68,90.17 105.41,88.9 JP1.4 | v60.96,96.52 v46.99,82.55
  Bottom 0.61: v46.99,82.55 50.8,78.74 50.8,74.93 57.15,68.58 57.15,64.77 64.77,57.15 73.66,57.15 74.93,55.88 74.93,54.61 IC1.17 | v60.96,96.52 73.66,96.52 90.17,80.01 90.17,78.74 X8.6
LCD/RS  (via drill 0.71)
  Top 0.61: v96.52,91.44 85.09,80.01 85.09,78.74 X8.4 85.09,77.47 71.12,63.5 v71.12,62.23
  Bottom 0.61: v96.52,91.44 102.87,85.09 JP1.1 | v71.12,62.23 77.47,55.88 77.47,54.61 IC1.18
MRX  (via drill 0.71)
  Top 0.61: v120.65,33.02 121.92,33.02 129.54,40.64 129.54,43.18 134.62,48.26 134.62,80.01 121.92,92.71 118.11,88.9 JP8.4
  Bottom 0.61: v120.65,33.02 111.76,41.91 106.68,41.91 105.41,43.18 101.6,43.18 100.33,44.45 100.33,45.72 IC1.2
MTX  (via drill 0.71)
  Top 0.61: v96.52,38.1 97.79,39.37 97.79,45.72 IC1.3 | v110.49,20.32 111.76,20.32 v142.24,50.8
  Bottom 0.61: v96.52,38.1 97.79,36.83 100.33,36.83 101.6,35.56 104.14,35.56 106.68,33.02 106.68,24.13 v110.49,20.32 | v142.24,50.8 142.24,60.96 118.11,85.09 JP8.3
N$1
  Bottom 0.61: Q2.2 99.06,31.75 99.06,29.21 101.6,26.67 102.87,26.67 IC2.2
N$2  (via drill 0.71)
  Top 0.61: v90.17,90.17 80.01,90.17 v77.47,87.63 | v63.5,93.98 40.64,71.12 39.37,71.12 38.1,69.85 38.1,67.31 41.91,63.5 R7.1
  Bottom 0.61: v90.17,90.17 99.06,81.28 111.76,81.28 113.03,80.01 113.03,78.74 X8.15 | v77.47,87.63 69.85,87.63 v63.5,93.98
N$3
  Bottom 0.61: Q2.1 96.52,31.75 96.52,29.21 101.6,24.13 102.87,24.13 IC2.1
N$4  (via drill 0.71)
  Top 0.61: v46.99,35.56 41.91,30.48 41.91,27.94 LED1.A | v46.99,52.07 59.69,64.77 R2.2
  Bottom 0.61: v46.99,52.07 v46.99,35.56
N$5
  Top 0.61: 77.47,35.56 74.93,33.02 74.93,30.48 C3.2 | 77.47,35.56 77.47,36.83 82.55,41.91 82.55,45.72 IC1.9 | 77.47,35.56 Q1.2
N$6
  Top 0.61: 72.39,35.56 71.12,34.29 71.12,30.48 C4.2 | 72.39,35.56 80.01,43.18 80.01,45.72 IC1.10 | 72.39,35.56 Q1.1
N$7
  Top 0.61: Q3.2 125.73,59.69 125.73,62.23 127,63.5 123.19,67.31 114.3,58.42 R3.1
N$8
  Bottom 0.61: SG1.- 129.54,50.8 129.54,58.42 Q3.3
N$9
  Bottom 0.61: X8.3 82.55,77.47 78.74,73.66 77.47,74.93 74.93,74.93 68.58,81.28 58.42,81.28 55.88,78.74 R6.2
N$11  (via drill 0.71)
  Top 0.61: v110.49,35.56 107.95,33.02 107.95,31.75 105.41,29.21 104.14,29.21 IC2.3
  Bottom 0.61: v110.49,35.56 114.3,35.56 127,22.86 BAT1.1
N$15
  Top 0.61: D6.A 20.32,36.83 6.35,36.83 X7.4
N$16
  Top 0.61: R10.2 20.32,43.18 24.13,43.18 29.21,48.26 R8.1
  Bottom 0.61: Q4.2 34.29,45.72 31.75,45.72 30.48,46.99 R8.1
N$17
  Top 0.61: S2.1 33.02,10.16 33.02,3.81 JP2.1
  Bottom 0.61: JP11.1 57.15,5.08 54.61,2.54 33.02,2.54 JP2.1
N$18
  Top 0.61: Q5.2 173.99,17.78 168.91,17.78 166.37,15.24 R11.1
N$19
  Top 0.61: Q5.1 175.26,21.59 179.07,21.59 180.34,22.86 LED2.A
N$20
  Bottom 0.61: LED2.K 180.34,25.4 176.53,25.4 172.72,21.59 168.91,25.4 R12.2
N$21
  Top 0.61: Q5.3 175.26,15.24 176.53,15.24 187.96,26.67 D1.A
  Bottom 0.61: K1.2 194.31,27.94 187.96,27.94 D1.A
N$22
  Top 0.61: 6.35,22.86 15.24,31.75 20.32,31.75 D5.A | 6.35,22.86 13.97,15.24 J1.1 | 6.35,22.86 X7.1
N$23
  Top 0.61: JP2.2 30.48,3.81 30.48,10.16 S2.2 30.48,11.43 30.48,17.78 BATT.1
  Bottom 0.61: D5.C 30.48,31.75 30.48,27.94 26.67,24.13 31.75,19.05 BATT.1
N$24  (via drill 3 pad 6.45)
  other vias: 220,4
N$27
  Top 0.61: R15.2 20.32,53.34 24.13,53.34 29.21,58.42 R13.1
  Bottom 0.61: Q6.2 34.29,55.88 31.75,55.88 30.48,57.15 R13.1
N$28
  Top 0.61: Q7.2 175.26,35.56 170.18,35.56 167.64,33.02 R16.1
N$29
  Top 0.61: Q7.1 175.26,39.37 179.07,39.37 180.34,40.64 LED3.A
N$30
  Top 0.61: LED3.K 180.34,43.18 171.45,43.18 R17.2
N$31
  Top 0.61: Q7.3 175.26,33.02 177.8,33.02 187.96,43.18 D2.A 187.96,44.45 194.31,44.45 K2.2
N$32
  Top 0.61: Q8.2 34.29,67.31 30.48,67.31 R18.1 29.21,68.58 24.13,63.5 20.32,63.5 R20.2
N$33
  Top 0.61: Q9.2 175.26,53.34 168.91,53.34 167.64,52.07 R21.1
N$34
  Top 0.61: Q9.1 175.26,57.15 179.07,57.15 180.34,58.42 LED4.A
N$35
  Top 0.61: LED4.K 180.34,60.96 171.45,60.96 R22.2
N$36
  Top 0.61: Q9.3 175.26,50.8 177.8,50.8 186.69,59.69 D3.A 187.96,60.96 194.31,60.96 K3.2
N$37
  Top 0.61: R25.2 20.32,73.66 24.13,73.66 29.21,78.74 R23.1
  Bottom 0.61: Q10.2 34.29,76.2 31.75,76.2 30.48,77.47 R23.1
N$38
  Top 0.61: Q11.2 180.34,69.85 173.99,76.2 166.37,68.58 R26.1
N$39
  Top 0.61: Q11.1 181.61,72.39 181.61,76.2 LED5.A
N$40
  Top 0.61: LED5.K 181.61,78.74 170.18,78.74 R27.2
N$41
  Top 0.61: Q11.3 181.61,67.31 182.88,67.31 184.15,68.58 184.15,76.2 186.69,78.74 D4.A 187.96,80.01 194.31,80.01 K4.2
N$44  (via drill 3 pad 6.45)
  other vias: 220.38,95.99
N$45  (via drill 3 pad 6.45)
  other vias: 4.01,96.35
N$47  (via drill 3 pad 6.45)
  other vias: 4.02,3.85
N$50
  Top 0.61: LED7.A 55.88,27.94 53.34,25.4 53.34,17.78 44.45,8.89 44.45,5.08 46.99,2.54 49.53,5.08 JP11.7
N$51
  Top 0.61: LED7.K 55.88,24.13 55.88,15.24 49.53,8.89 JP11.8
NC1
  Bottom 0.61: X4.3 218.44,34.29 209.55,25.4 207.01,27.94 K1.O
NC2
  Top 0.61: X5.2 218.44,48.26 210.82,48.26 207.01,44.45 K2.O
NC3
  Top 0.61: X6.1 218.44,63.5 208.28,63.5 207.01,62.23 K3.O
NC4
  Top 0.61: X6.4 218.44,80.01 207.01,80.01 K4.O
NO1
  Top 0.61: X4.1 218.44,24.13 215.9,24.13 207.01,15.24 K1.S
NO2
  Top 0.61: X4.4 218.44,39.37 213.36,39.37 207.01,33.02 K2.S
NO3
  Top 0.61: X5.3 218.44,53.34 209.55,53.34 207.01,50.8 K3.S
NO4
  Top 0.61: X6.2 218.44,68.58 208.28,68.58 207.01,67.31 K4.S
PRX
  Top 0.61: JP1.10 113.03,88.9 115.57,88.9 JP8.2
PTX
  Top 0.61: JP1.9 113.03,86.36 115.57,86.36 JP8.1
RST  (via drill 0.71)
  Top 0.61: S1.4 2.54,83.82 2.54,88.9 S1.3 | v124.46,63.5 v109.22,48.26 | v116.84,83.82 109.22,83.82 107.95,85.09 | v72.39,82.55 85.09,82.55 v92.71,90.17 | v99.06,83.82 106.68,83.82 107.95,85.09 | 107.95,85.09 JP1.5
  Bottom 0.61: S1.3 2.54,88.9 6.35,85.09 8.89,85.09 10.16,83.82 19.05,83.82 R1.1 20.32,83.82 26.67,83.82 40.64,97.79 57.15,97.79 v72.39,82.55 | v109.22,48.26 107.95,46.99 102.87,46.99 IC1.1 | v124.46,63.5 124.46,76.2 v116.84,83.82 | v99.06,83.82 v92.71,90.17
SCL  (via drill 0.71)
  Top 0.61: IC3.6 92.71,29.21 102.87,19.05 106.68,22.86 106.68,26.67 109.22,29.21 110.49,29.21 IC2.6 111.76,29.21 113.03,29.21 118.11,34.29 v118.11,44.45
  Bottom 0.61: IC1.28 102.87,54.61 106.68,58.42 110.49,54.61 R5.2 111.76,53.34 111.76,50.8 v118.11,44.45
SDA
  Top 0.61: 96.52,35.56 105.41,44.45 105.41,50.8 107.95,53.34 R4.2 107.95,54.61 102.87,49.53 100.33,52.07 100.33,53.34 IC1.27 | 96.52,35.56 92.71,31.75 IC3.5 | 96.52,35.56 102.87,35.56 107.95,40.64 113.03,35.56 111.76,34.29 111.76,31.75 IC2.5
SN1
  Top 0.61: R8.2 19.05,48.26 6.35,48.26 X2.2
SN2
  Top 0.61: R13.2 19.05,58.42 6.35,58.42 X2.4
SN3
  Top 0.61: R18.2 19.05,68.58 6.35,68.58 X3.2
SN4
  Top 0.61: R23.2 19.05,78.74 16.51,78.74 8.89,71.12 3.81,71.12 2.54,72.39 2.54,74.93 5.08,77.47 X3.4
VDD  (via drill 0.71)
  Top 0.61: R6.3 52.07,76.2 52.07,71.12 46.99,66.04 46.99,60.96 45.72,59.69 45.72,57.15 43.18,54.61 R7.2 | v71.12,68.58 80.01,77.47 X8.2
  Bottom 0.61: v71.12,68.58 60.96,68.58 53.34,76.2 R6.3
VSS  (via drill 0.71)
  Top 0.61: v67.31,71.12 68.58,71.12 72.39,74.93 74.93,74.93 77.47,77.47 X8.1 | v100.33,63.5 111.76,74.93 113.03,74.93 115.57,77.47 X8.16
  Bottom 0.61: v67.31,71.12 62.23,76.2 58.42,76.2 R6.1 | X8.1 77.47,78.74 76.2,80.01 77.47,81.28 86.36,81.28 87.63,80.01 87.63,78.74 X8.5 87.63,77.47 87.63,76.2 v100.33,63.5

### Text on the board
Top: SG44 | V3.3 | 240513 | NpN Automation Technologies | Pvt. Ltd. Indore
Bottom: SG44 | V3.3 | 240513 | NpN Automation Technologies | Pvt. Ltd. Indore